# EasyEDA Pro project exBoard_3.eprj

# Schematic Schematic1
Board Name: Board1; Create Date: 2024-05-28; Page Name: P1; Project Name: exBoard_2; Schematic Name: Schematic1; Update Date: 2024-12-31; Company: 嘉立创EDA; Page Size: A4; Version: V1.0
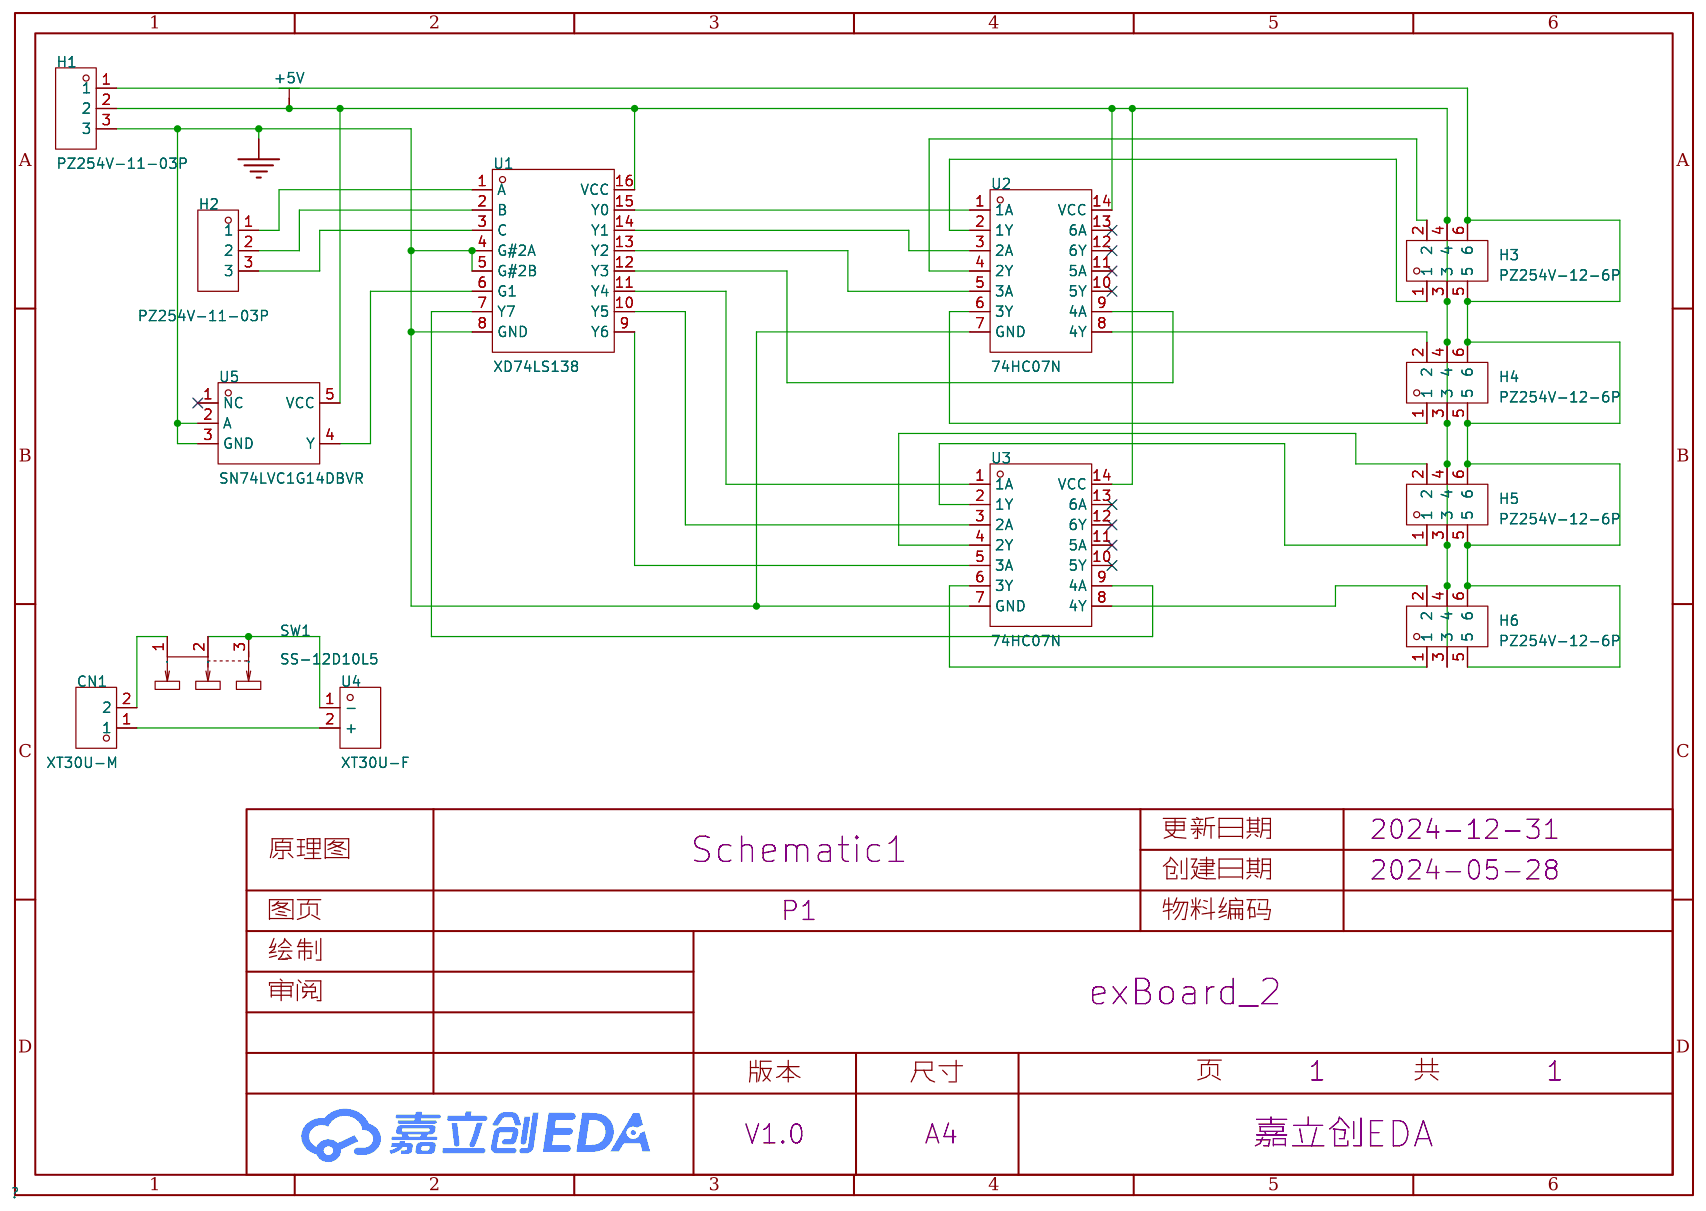
[diagram p0: schematic sheet]

## Parts
CN1  XT30U-M  [CONN-TH_XT30U-M]
H1  PZ254V-11-03P  [HDR-TH_3P-P2.54-V-M]
H2  PZ254V-11-03P  [HDR-TH_3P-P2.54-V-M]
H3  PZ254V-12-6P  [HDR-TH_6P-P2.54-V-M-R2-C3-S2.54]
H4  PZ254V-12-6P  [HDR-TH_6P-P2.54-V-M-R2-C3-S2.54]
H5  PZ254V-12-6P  [HDR-TH_6P-P2.54-V-M-R2-C3-S2.54]
H6  PZ254V-12-6P  [HDR-TH_6P-P2.54-V-M-R2-C3-S2.54]
SW1  SS-12D10L5  [SW-TH_SS-12D10L5]
U1  XD74LS138  [DIP-16_L19.8-W6.5-P2.54-LS7.6-BL]
U2  74HC07N  [DIP-14_L19.4-W6.4-P2.54-LS7.6-BL]
U3  74HC07N  [DIP-14_L19.4-W6.4-P2.54-LS7.6-BL]
U4  XT30U-F  [CONN-TH_XT30U-F]
U5  SN74LVC1G14DBVR  [SOT-23-5_L3.0-W1.7-P0.95-LS2.8-BR]

## Library data of the parts
CN1 = XT30U-M: 类别:-;类型1:-;; LCSC Part Name: AMASS(艾迈斯)轻量版锂电池插头公头 XT30U-M; Supplier Part: C99101; Manufacturer: AMASS(艾迈斯); JLCPCB Part Class: 扩展库; Datasheet: https://atta.szlcsc.com/upload/public/pdf/source/20170606/1496716542582.pdf; Supplier: LCSC; Brand: 艾迈斯; Type: 插头; Colour: 黄色; InterfaceType: 公头
H1 H2 = PZ254V-11-03P: LCSC Part Name: 间距:2.54mm 1x3P 直插 方针; Supplier Part: C2937625; Manufacturer: XFCN(兴飞); Supplier Footprint: 插件,P=2.54mm; JLCPCB Part Class: Extended Part; Datasheet: https://atta.szlcsc.com/upload/public/pdf/source/20200309/C492402_8335C3D49C4E4C618838D59BB1D024C1.pdf; Supplier: LCSC; Pin Structure: 1x3P; Pitch: 2.54mm; Circluar Pins/Square Pins: 方针; Mounting Type: 直插; Number of Rows: 单排; Number of Pins: 3P; Current Rating (Max): 3A; Voltage Rating (Max): 250V; Length of Mating Pin: 6mm; Insulation Height: 2.5mm; Length of End Connection Pin: 3mm; Operating Temperature Range: -40℃~+105℃; Color: 黑色
H3-H6 = PZ254V-12-6P: LCSC Part Name: 间距:2.54mm 2x3P 直插 方针; Supplier Part: C492420; Manufacturer: XFCN(兴飞); Supplier Footprint: 插件,P=2.54mm; JLCPCB Part Class: Extended Part; Datasheet: https://atta.szlcsc.com/upload/public/pdf/source/20200309/C492420_BAECB307B001054C09D200388220EAE6.pdf; Supplier: LCSC; Pin Structure: 2x3P; Pitch: 2.54mm; Row Spacing: 2.54mm; Circluar Pins/Square Pins: 方针; Mounting Type: 直插; Number of Rows: 双排; Number of Pins: 6P; Length of Mating Pin: 6mm; Insulation Height: 2.5mm; Length of End Connection Pin: 3mm; Contact Material: 黄铜; Operating Temperature Range: -40℃~+105℃; Color: 黑色
SW1 = SS-12D10L5: LCSC Part Name: 柄长5mm 直插双档 滑动开关; Supplier Part: C319012; Manufacturer: XKB Connectivity(中国星坤); Supplier Footprint: 插件; JLCPCB Part Class: 扩展库; Datasheet: https://atta.szlcsc.com/upload/public/pdf/source/20211009/D6412F37AABE6F9459A6EE7FA4DAEADB.pdf; Supplier: LCSC; Circuit: 单刀双掷; Actuator Style: 矩形柱状; Pin Style: PC引脚; Switch Length: 13mm; Switch Width: 6.8mm; Switch Height: 6.4mm; Mounting Style: 直插; Actuator Color: 黑色; Current Rating (DC): 3A; Voltage Rating (DC): 125V; Current Rating (AC): 3A; Voltage Rating (AC): 125V; Mechanical Life: 1万次; Operating Temperature: -40℃~+85℃
U1 = XD74LS138: LCSC Part Name: 编码器、解码器、复用器和解复用器; Supplier Part: C513527; Manufacturer: XINLUDA(信路达); Supplier Footprint: DIP-16; JLCPCB Part Class: Extended Part; Datasheet: https://atta.szlcsc.com/upload/public/pdf/source/20200619/C513527_D04113946337FFA11528F3555AE2E14A.pdf; Supplier: LCSC
U2 U3 = 74HC07N: LCSC Part Name: 三态缓冲器; Supplier Part: C507191; Manufacturer: HGSEMI(华冠); Supplier Footprint: DIP-14; JLCPCB Part Class: Extended Part; Datasheet: https://atta.szlcsc.com/upload/public/pdf/source/20200402/C507191_D85B46125E3A0A7EFEB90895E388FB75.pdf; Supplier: LCSC
U4 = XT30U-F: LCSC Part Name: AMASS(艾迈斯)轻量版锂电池插头母头 XT30U-F; Supplier Part: C99102; Manufacturer: AMASS(艾迈斯); JLCPCB Part Class: 扩展库; Datasheet: https://atta.szlcsc.com/upload/public/pdf/source/20190916/C428721_B0ECB8C5937139CEFE8736D2D3175B0E.pdf; Supplier: LCSC; Brand: 艾迈斯; Type: 插头; Colour: 黄色; InterfaceType: 母头
U5 = SN74LVC1G14DBVR_C434069: LCSC Part Name: 门极和反相器; Supplier Part: C434069; Manufacturer: UMW(友台半导体); Supplier Footprint: SOT-23-5; JLCPCB Part Class: 扩展库; Datasheet: https://atta.szlcsc.com/upload/public/pdf/source/20231109/6055D1B61DE2E899F5391931885BEAFC.pdf; Supplier: LCSC; Input Type: 施密特触发器; Supply Voltage(Single): 1.65V~5.5V; Supply Current (Max): 10uA; Number of Circuits: 1; Number of Inputs: 1; Sink Current: 32mA; Source Current: 32mA; High level range (VIH): 1V~3V; Low level range (VIL): 500mV~1.9V; Max Propagation Delay: 20ns@5V,15pF; Series: 74LVC系列; Operating Temperature: -40℃~+105℃

## Nets
+5V: H1.2 H3.3 H3.4 H4.3 H4.4 H5.3 H5.4 H6.3 H6.4 U1.16(VCC) U2.14(VCC) U3.14(VCC) U5.5(VCC)
GND: H1.3 U1.4(G#2A) U1.5(G#2B) U1.8(GND) U2.7(GND) U3.7(GND) U5.2(A) U5.3(GND)
$1N380: CN1.1 U4.2(+)
$1N10441: H2.1 U1.1(A)
$1N10447: H2.2 U1.2(B)
$1N10453: H2.3 U1.3(C)
$1N11930: U1.15(Y0) U2.1(1A)
$1N11941: U1.14(Y1) U2.3(2A)
$1N11950: U1.13(Y2) U2.5(3A)
$1N11960: U1.12(Y3) U2.9(4A)
$1N11978: U1.11(Y4) U3.1(1A)
$1N11984: U1.10(Y5) U3.3(2A)
$1N11991: U1.9(Y6) U3.5(3A)
$1N12312: U1.7(Y7) U3.9(4A)
$1N12357: H3.2 U2.4(2Y)
$1N12360: H3.1 U2.2(1Y)
$1N12404: H4.1 U2.6(3Y)
$1N12414: H4.2 U2.8(4Y)
$1N12434: H5.1 U3.2(1Y)
$1N12445: H5.2 U3.4(2Y)
$1N12460: H6.1 U3.6(3Y)
$1N13302: CN1.2 SW1.1
$1N13307: SW1.2 SW1.3 U4.1(-)
$1N14076: U1.6(G1) U5.4(Y)
$1N14136: H6.2 U3.8(4Y)
$1N14187: H1.1 H3.5 H3.6 H4.5 H4.6 H5.5 H5.6 H6.5 H6.6

Not connected (* = marked no-connect by the designer): U2 10(5Y)* 11(5A)* 12(6Y)* 13(6A)*; U3 10(5Y)* 11(5A)* 12(6Y)* 13(6A)*; U5 1(NC)*

# Board PCB7
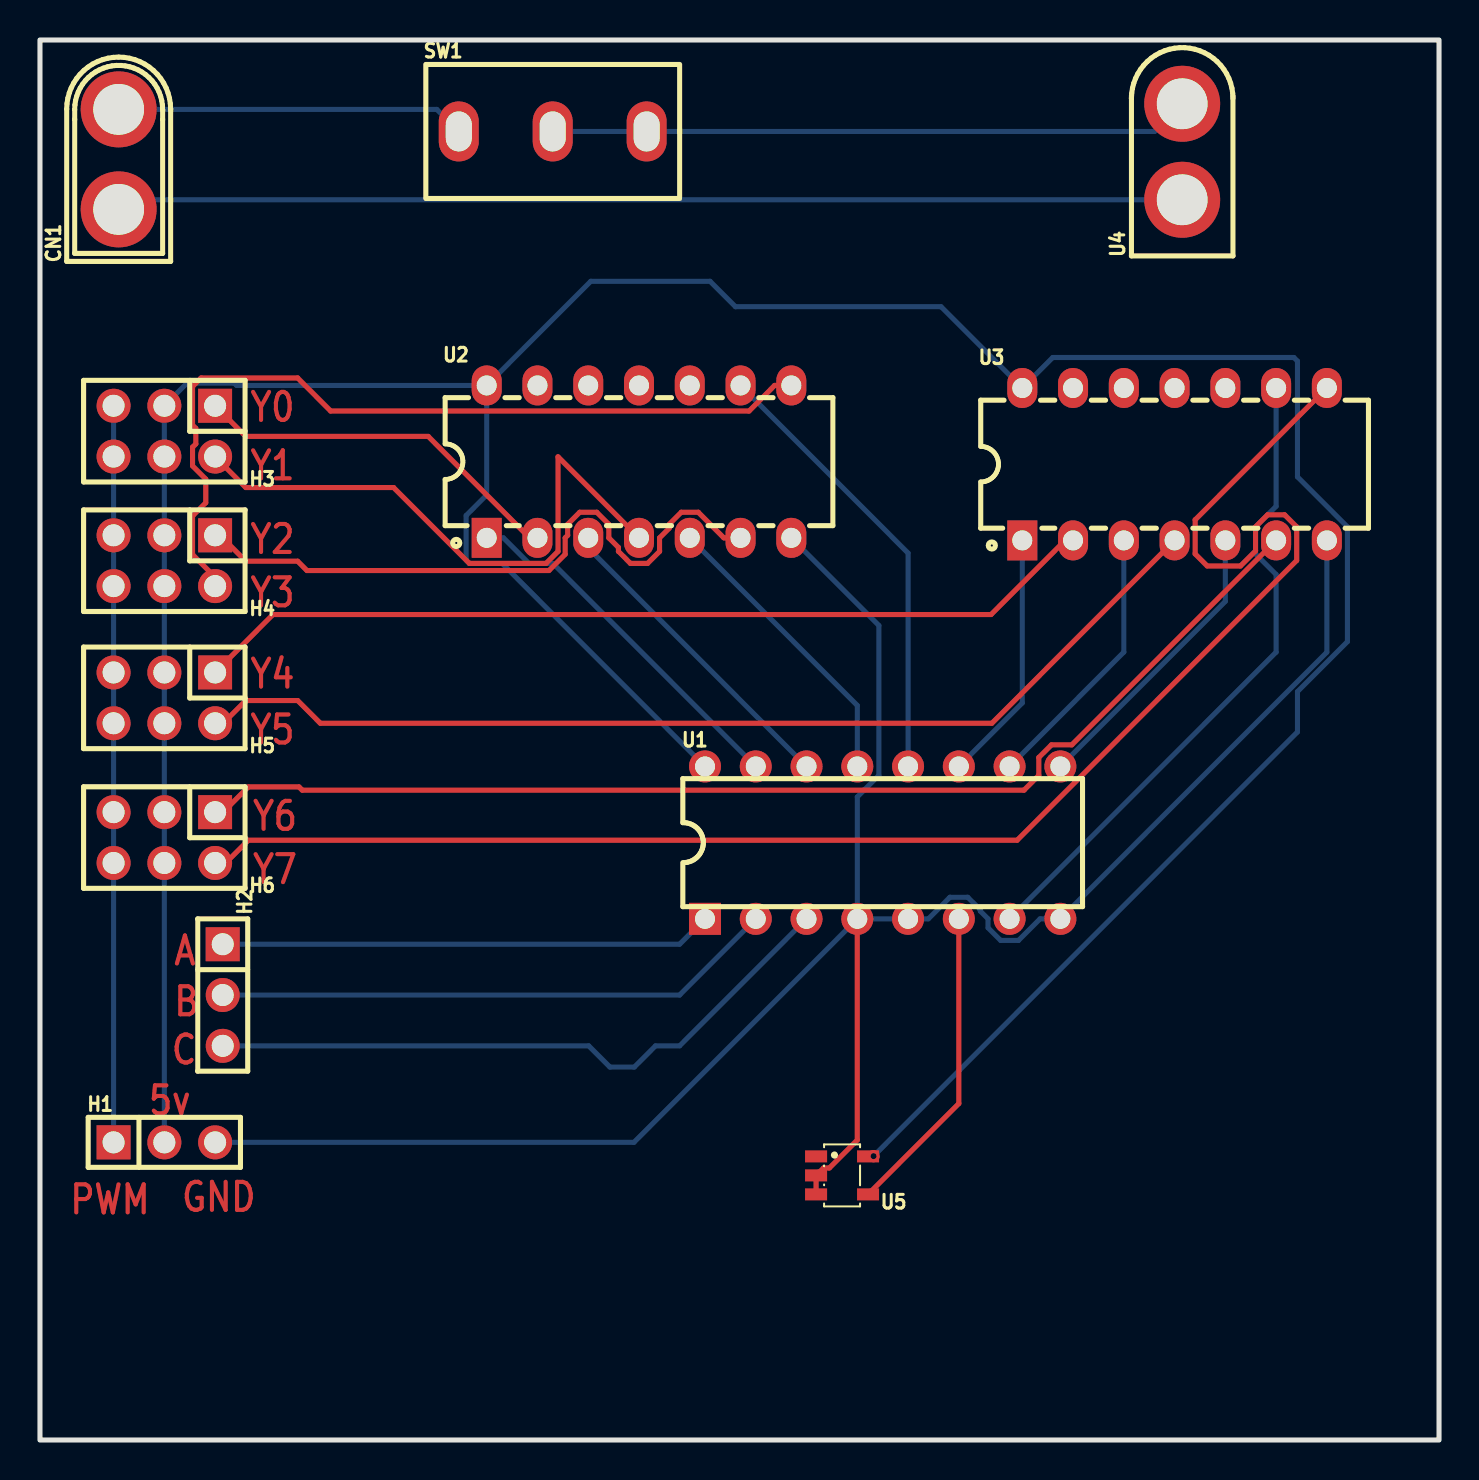
[diagram p1: board, top side]
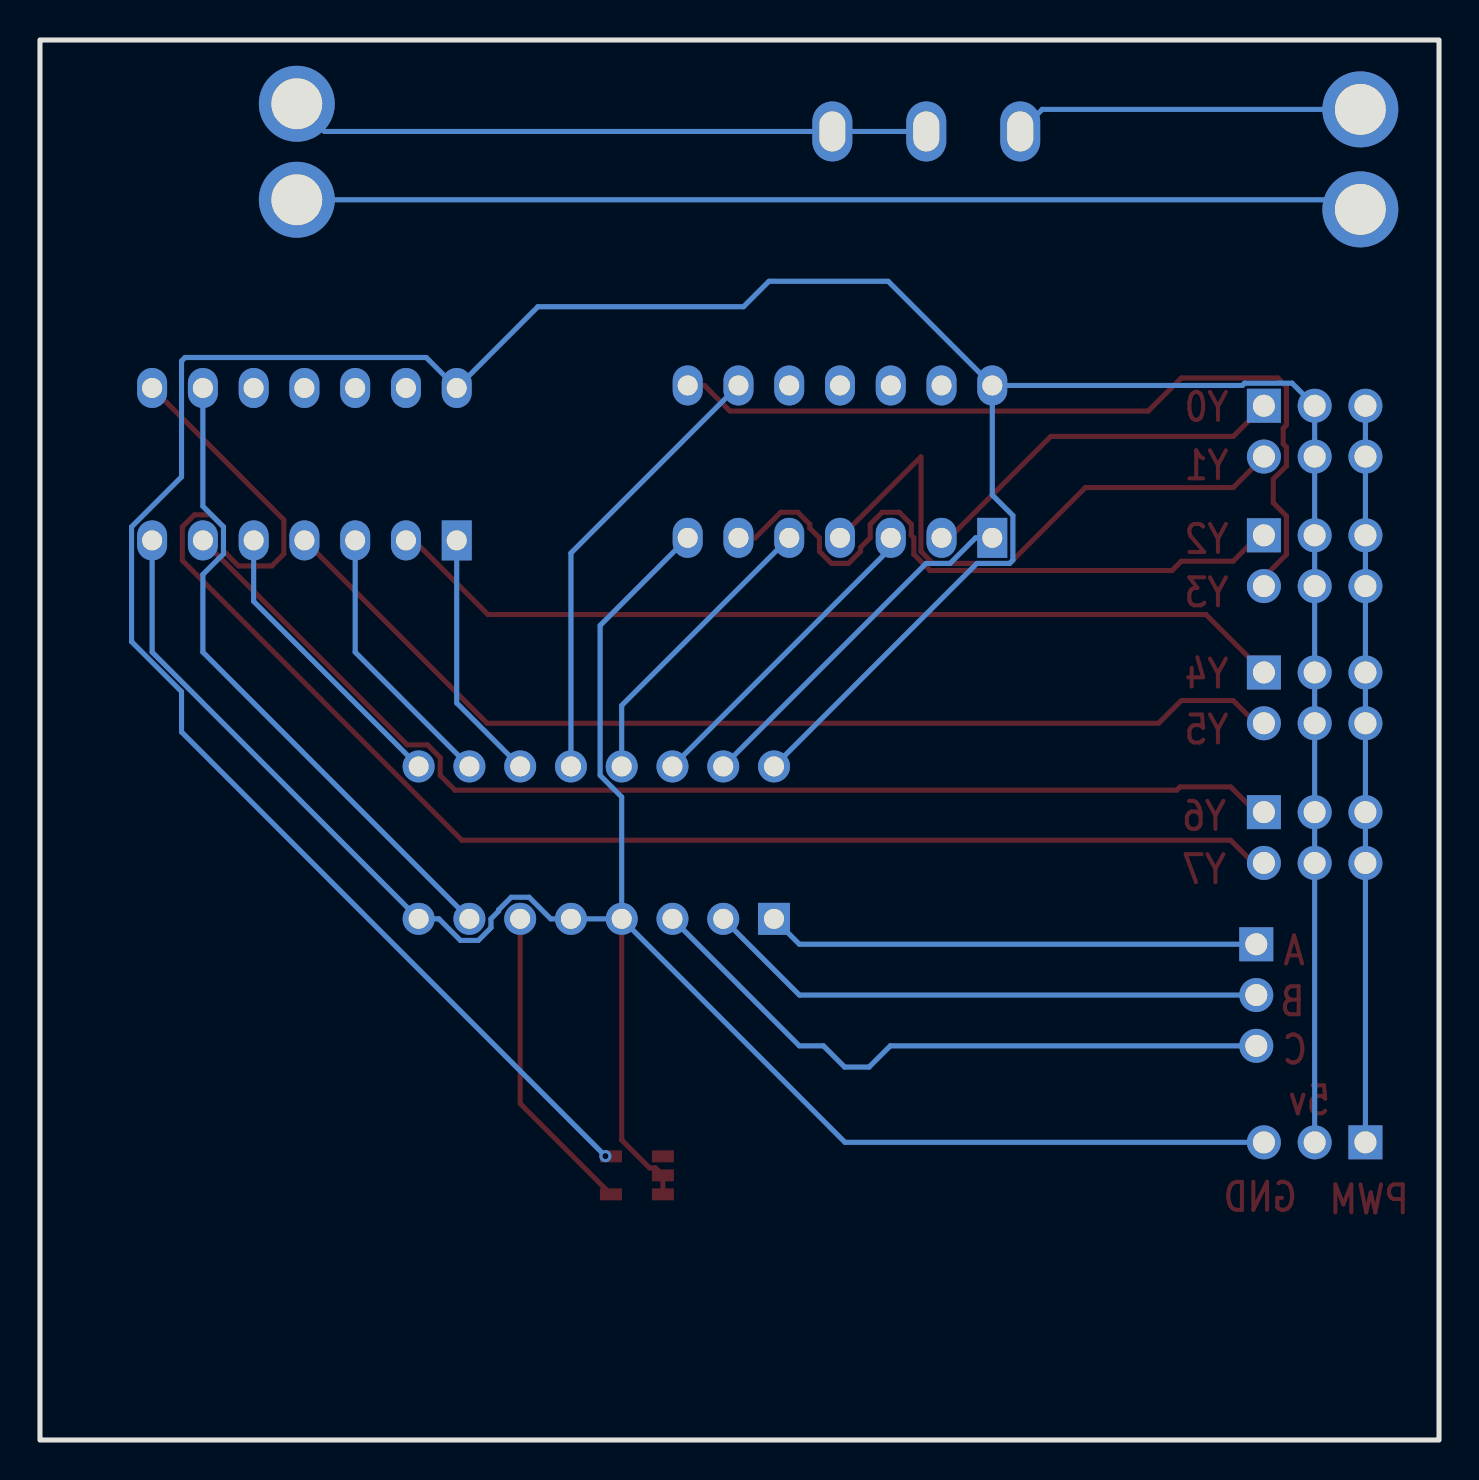
[diagram p2: board, bottom side, seen from below]

Outline 70 x 70 mm; copper layers: Top Layer, Bottom Layer. Coordinates in mm from the lower left corner of the outline.
Outline path: rectangle 0,70 70,0
Stack: Top Layer 0.035mm / Dielectric1 1.51mm FR4 er 4.5 / Bottom Layer 0.035mm

## Design rules (mm)
template: JLCPCB Capability(Two Layers Board)
spacing copperThickness1oz (default): track to track 0.102, other pairs 0.152 to 0.3
spacing copperThickness2oz: track to track 0.203, other pairs 0.152 to 0.3
track width copperThickness1oz (default): min 0.127, default 0.254, max 2.54
track width copperThickness2oz: min 0.203, default 0.254, max 2.54
differential pair differentialPair (default): width min 0.127, default 0.254, max 2.54; gap min 0.152, default 0.152
via viaSize (default): diameter min 0.5, default 0.61, max 10; hole min 0.3, default 0.305, max 6.3

## Placement (name value [footprint] x y rotation side)
CN1  XT30U-M  [CONN-TH_XT30U-M]  3.94 64.03 90 top
H1  PZ254V-11-03P  [HDR-TH_3P-P2.54-V-M]  6.22 14.88 0 top
H2  PZ254V-11-03P  [HDR-TH_3P-P2.54-V-M]  9.14 22.25 270 top
H3  PZ254V-12-6P  [HDR-TH_6P-P2.54-V-M-R2-C3-S2.54]  6.22 50.44 180 top
H4  PZ254V-12-6P  [HDR-TH_6P-P2.54-V-M-R2-C3-S2.54]  6.22 43.97 180 top
H5  PZ254V-12-6P  [HDR-TH_6P-P2.54-V-M-R2-C3-S2.54]  6.22 37.11 180 top
H6  PZ254V-12-6P  [HDR-TH_6P-P2.54-V-M-R2-C3-S2.54]  6.22 30.12 180 top
SW1  SS-12D10L5  [SW-TH_SS-12D10L5]  25.65 65.43 0 top
U1  XD74LS138  [DIP-16_L19.8-W6.5-P2.54-LS7.6-BL]  42.16 29.87 0 top
U2  74HC07N  [DIP-14_L19.4-W6.4-P2.54-LS7.6-BL]  29.97 48.92 0 top
U3  74HC07N  [DIP-14_L19.4-W6.4-P2.54-LS7.6-BL]  56.77 48.79 0 top
U4  XT30U-F  [CONN-TH_XT30U-F]  57.15 64.41 90 top
U5  SN74LVC1G14DBVR  [SOT-23-5_L3.0-W1.7-P0.95-LS2.8-BR]  40.13 13.23 180 top

## Footprints (pads in the part's own frame, mm; a bottom-side part is the same pattern mirrored in y, then rotated)
CONN-TH_XT30U-F
  round 3.8 hole 2.54: 1(2.4,0) 2(-2.4,0)
CONN-TH_XT30U-M
  round 3.8 hole 2.54: 1(-2.5,0) 2(2.5,0)
DIP-14_L19.4-W6.4-P2.54-LS7.6-BL
  rect 1.5x2 hole 1: 1(-7.62,-3.811)
  oval 1.5x2 hole 1: 2(-5.08,-3.811) 3(-2.54,-3.811) 4(0,-3.811) 5(2.54,-3.811) 6(5.08,-3.811) 7(7.62,-3.811) 8(7.62,3.811) 9(5.08,3.809) 10(2.54,3.809) 11(0,3.809) 12(-2.54,3.809) 13(-5.08,3.809) 14(-7.62,3.809)
DIP-16_L19.8-W6.5-P2.54-LS7.6-BL
  rect 1.6x1.6 hole 1: 1(-8.89,-3.81)
  round 1.6 hole 1: 2(-6.35,-3.81) 3(-3.81,-3.81) 4(-1.27,-3.81) 5(1.27,-3.81) 6(3.81,-3.81) 7(6.35,-3.81) 8(8.89,-3.81) 9(8.89,3.81) 10(6.35,3.81) 11(3.81,3.81) 12(1.27,3.81) 13(-1.27,3.81) 14(-3.81,3.81) 15(-6.35,3.81) 16(-8.89,3.81)
HDR-TH_3P-P2.54-V-M
  rect 1.7x1.7 hole 1.1: 1(-2.54,0)
  round 1.7 hole 1.1: 2(0,0) 3(2.54,0)
HDR-TH_6P-P2.54-V-M-R2-C3-S2.54
  rect 1.7x1.7 hole 1.1: 1(-2.54,-1.27)
  round 1.7 hole 1.1: 2(-2.54,1.27) 3(0,-1.27) 4(0,1.27) 5(2.54,-1.27) 6(2.54,1.27)
SOT-23-5_L3.0-W1.7-P0.95-LS2.8-BR
  rect 1.1x0.6 smd: 1(1.3,-0.95) 2(1.3,0) 3(1.3,0.95) 4(-1.3,0.95) 5(-1.3,-0.95)
SW-TH_SS-12D10L5
  oval 2x3 hole 1.3x2: 1(-4.7,0) 2(0,0) 3(4.7,0)

## Nets
As in the schematic.

Pads without a net: U2 10 11 12 13; U3 10 11 12 13; U5 1

## Via types
v1: diameter 0.61, hole 0.305, Top Layer to Bottom Layer, 1 via

## Routing (per net, layer and track width the routed paths; a pad name or vN(x,y) marks a point on that pad's centre or on a via; arc(x,y) is an arc through that point)
+5V: length 175.1
  Bottom Layer w0.254: U2.14 22.35,47.25 21.32,46.22 21.32,43.99 21.49,43.83 23.12,43.83 U1.16 ; U2.14 27.56,57.94 33.53,57.94 34.8,56.67 45.08,56.67 U3.14 50.67,54.13 62.74,54.13 62.92,53.95 62.92,48.16 65.42,45.66 65.42,39.92 62.92,37.42 62.92,35.4 v1(41.71,14.19) ; U2.14 9.84,52.73 9.73,52.84 7.35,52.84 H3.3 H3.4 H4.3 H4.4 H5.3 H5.4 H6.3 H1.2
GND: length 109.6
  Top Layer w0.254: U1.4 40.89,15 39.5,13.6 39.2,13.6 U5.2 U5.3
  Bottom Layer w0.254: U1.4 40.89,32.15 41.97,33.23 41.97,40.73 U2.7 ; U1.4 U1.5 44.45,26.06 45.53,27.14 46.42,27.14 47.05,26.51 47.05,26.44 47.43,26.06 47.43,25.61 48.07,24.98 48.96,24.98 50.04,26.06 U1.8 64.39,39.39 U3.7 ; U1.4 29.72,14.88 H1.3
$1N380: length 53.4
  Bottom Layer w0.254: U4.2 4.42,62.01 CN1.1
$1N10441: length 24.7
  Bottom Layer w0.254: U1.1 32,24.79 H2.1
$1N10447: length 28.2
  Bottom Layer w0.254: H2.2 32,22.25 U1.2
$1N10453: length 32.7
  Bottom Layer w0.254: U1.3 32,19.71 30.8,19.71 29.74,18.65 28.51,18.65 27.45,19.71 H2.3
$1N11930: length 18.2
  Bottom Layer w0.254: U1.15 25.66,43.83 24.47,43.83 23.19,45.11 U2.1
$1N11941: length 16
  Bottom Layer w0.254: U2.3 27.43,44.6 U1.14
$1N11950: length 14.9
  Bottom Layer w0.254: U2.5 40.89,36.73 U1.13
$1N11960: length 22.5
  Bottom Layer w0.254: U2.9 43.43,44.35 U1.12
$1N11978: length 12.6
  Bottom Layer w0.254: U3.1 49.15,36.85 U1.11
$1N11984: length 13.7
  Bottom Layer w0.254: U3.3 54.23,39.39 U1.10
$1N11991: length 14.7
  Bottom Layer w0.254: U3.5 59.31,41.93 U1.9
$1N12312: length 32.9
  Bottom Layer w0.254: U1.7 61.85,39.39 61.85,43.28 60.82,44.3 60.82,45.66 61.85,46.69 U3.9
$1N12357: length 30.1
  Top Layer w0.254: H3.2 8.76,49.16 10.3,47.62 17.69,47.62 21.49,43.83 25.32,43.83 25.92,44.43 25.92,49.16 U2.4
$1N12360: length 18.9
  Top Layer w0.254: U2.2 24.5,45.11 19.42,50.18 10.29,50.18 H3.1
$1N12404: length 32.7
  Top Layer w0.254: H4.1 8.89,45.11 9.13,45.11 10.3,43.94 12.89,43.94 13.36,43.47 25.47,43.47 26.28,44.28 26.28,45.11 26.4,45.23 26.4,45.78 27.01,46.39 27.86,46.39 28.46,45.78 28.46,45.11 28.94,44.63 28.94,44.43 29.55,43.83 30.4,43.83 31,44.43 31,45.11 31.48,45.59 31.48,45.78 32.09,46.39 32.94,46.39 34.22,45.11 U2.6
$1N12414: length 42.5
  Top Layer w0.254: H4.2 8.76,43.14 7.63,44.27 7.63,46.2 8.3,46.86 8.3,48.04 7.63,48.7 7.63,49.64 7.8,49.8 7.8,50.58 7.63,50.75 7.63,52.68 8.06,53.1 12.89,53.1 14.55,51.45 35.48,51.45 36.76,52.73 U2.8
$1N12434: length 45.7
  Top Layer w0.254: H5.1 11.66,41.27 47.59,41.27 51.29,44.98 U3.2
$1N12445: length 52.7
  Top Layer w0.254: H5.2 9.16,35.84 10.3,36.97 12.89,36.97 14.03,35.84 47.63,35.84 U3.4
$1N12460: length 59.4
  Top Layer w0.254: H6.1 9.16,31.39 10.43,32.66 12.96,32.66 13.12,32.49 49.24,32.49 49.98,33.23 49.98,34.13 50.61,34.76 51.63,34.76 U3.6
$1N13302: length 17.5
  Bottom Layer w0.254: SW1.1 19.85,66.53 CN1.2
$1N13307: length 32.1
  Bottom Layer w0.254: SW1.2 55.77,65.43 U4.1
$1N14076: length 15.7
  Top Layer w0.254: U5.4 45.97,16.82 U1.6
$1N14136: length 80.4
  Top Layer w0.254: U3.8 57.8,46.01 57.8,44.3 58.4,43.7 60.07,43.7 60.82,44.46 60.82,45.66 61.42,46.26 62.27,46.26 62.88,45.66 62.88,43.98 48.89,29.99 10.43,29.99 9.29,28.85 8.76,28.85
$1N14187: length 36.8
  Bottom Layer w0.254: H1.1 H6.5 H5.6 H5.5 H4.6 H4.5 H3.6 H3.5

## Text on the board
Top Layer: PWM | 5v | C | A | B | GND | Y0 | Y1 | Y2 | Y3 | Y4 | Y5 | Y6 | Y7
